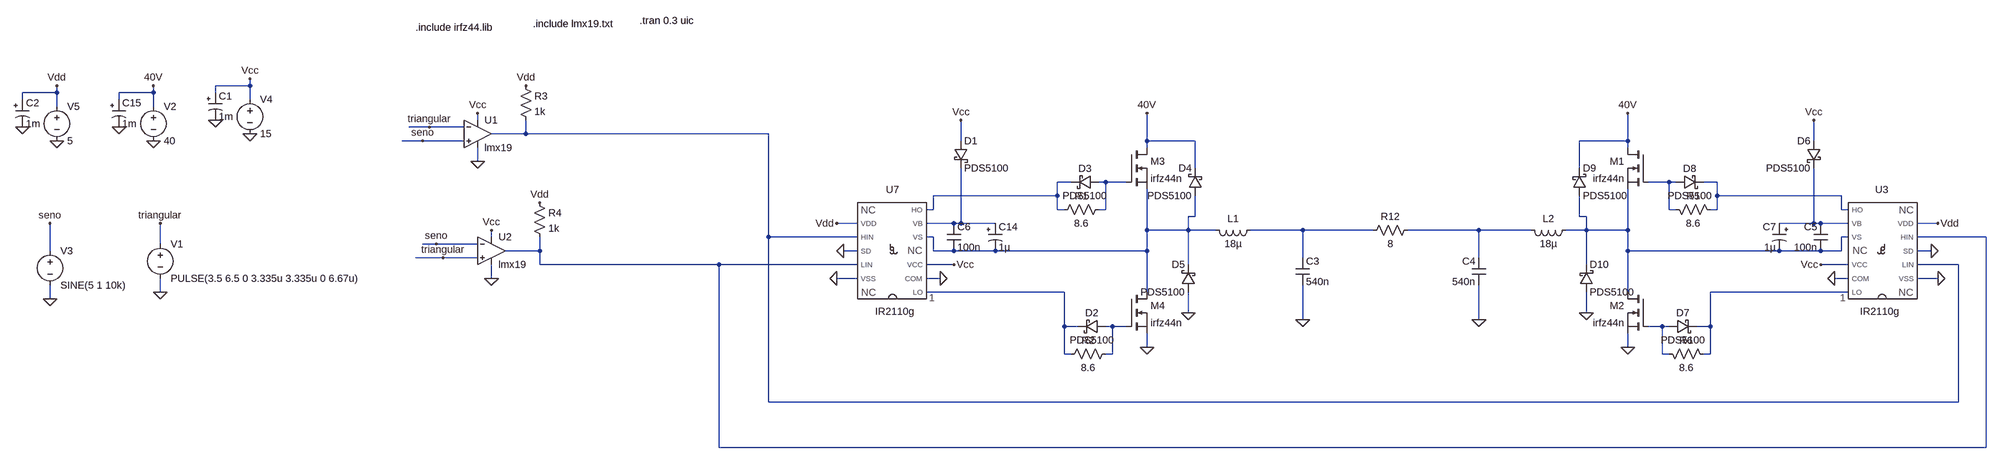
[diagram p0: schematic circuito_completo.asc]
circuito_completo.asc, the LTspice schematic file:
Version 4
SHEET 1 3828 1224
WIRE -704 48 -704 32
WIRE -704 48 -784 48
WIRE -1152 64 -1152 48
WIRE -1152 64 -1232 64
WIRE -928 64 -928 48
WIRE -928 64 -1008 64
WIRE -784 64 -784 48
WIRE -1232 80 -1232 64
WIRE -1008 80 -1008 64
WIRE -704 80 -704 48
WIRE -1152 96 -1152 64
WIRE -928 96 -928 64
WIRE -112 128 -112 112
WIRE -224 144 -272 144
WIRE -144 144 -224 144
WIRE 0 160 0 128
WIRE 0 160 -80 160
WIRE 656 160 0 160
WIRE -240 176 -288 176
WIRE -144 176 -240 176
WIRE 1216 176 1216 128
WIRE 1648 176 1648 112
WIRE 1760 176 1648 176
WIRE 2992 176 2992 112
WIRE 2992 176 2880 176
WIRE 3424 176 3424 128
WIRE 1648 192 1648 176
WIRE 2992 192 2992 176
WIRE -112 224 -112 192
WIRE 1760 240 1760 176
WIRE 2880 240 2880 176
WIRE 1472 272 1440 272
WIRE 1552 272 1536 272
WIRE 1600 272 1552 272
WIRE 3088 272 3040 272
WIRE 3104 272 3088 272
WIRE 3200 272 3168 272
WIRE 1440 304 1440 272
WIRE 1440 304 1152 304
WIRE 3200 304 3200 272
WIRE 3488 304 3200 304
WIRE 1152 336 1152 304
WIRE 1152 336 1136 336
WIRE 1440 336 1440 304
WIRE 1456 336 1440 336
WIRE 1552 336 1552 272
WIRE 1552 336 1536 336
WIRE 3088 336 3088 272
WIRE 3104 336 3088 336
WIRE 3200 336 3200 304
WIRE 3200 336 3184 336
WIRE 3488 336 3488 304
WIRE 3504 336 3488 336
WIRE 1760 352 1760 304
WIRE 1760 352 1744 352
WIRE 2880 352 2880 304
WIRE 2896 352 2880 352
WIRE 976 368 928 368
WIRE 1200 368 1136 368
WIRE 1216 368 1216 240
WIRE 1216 368 1200 368
WIRE 1296 368 1216 368
WIRE 3424 368 3424 240
WIRE 3424 368 3344 368
WIRE 3440 368 3424 368
WIRE 3504 368 3440 368
WIRE 3712 368 3664 368
WIRE 1648 384 1648 288
WIRE 1744 384 1744 352
WIRE 1744 384 1648 384
WIRE 1808 384 1744 384
WIRE 2096 384 1888 384
WIRE 2288 384 2096 384
WIRE 2560 384 2368 384
WIRE 2768 384 2560 384
WIRE 2896 384 2896 352
WIRE 2896 384 2848 384
WIRE 2992 384 2992 288
WIRE 2992 384 2896 384
WIRE -80 400 -80 384
WIRE 656 400 656 160
WIRE 976 400 656 400
WIRE 1152 400 1136 400
WIRE 3504 400 3488 400
WIRE 3824 400 3664 400
WIRE -912 416 -912 368
WIRE -208 416 -240 416
WIRE -112 416 -208 416
WIRE -1168 432 -1168 368
WIRE 32 432 32 400
WIRE 32 432 -48 432
WIRE 976 432 944 432
WIRE 1152 432 1152 400
WIRE 1200 432 1152 432
WIRE 1296 432 1200 432
WIRE 1648 432 1648 384
WIRE 1648 432 1296 432
WIRE 2992 432 2992 384
WIRE 3344 432 2992 432
WIRE 3440 432 3344 432
WIRE 3488 432 3488 400
WIRE 3488 432 3440 432
WIRE 3696 432 3664 432
WIRE -192 448 -256 448
WIRE -112 448 -192 448
WIRE 2096 448 2096 384
WIRE 2560 448 2560 384
WIRE 32 464 32 432
WIRE 448 464 32 464
WIRE 976 464 448 464
WIRE 1200 464 1136 464
WIRE 1744 464 1744 384
WIRE 2896 464 2896 384
WIRE 3504 464 3440 464
WIRE 3760 464 3664 464
WIRE -80 496 -80 464
WIRE 976 496 928 496
WIRE 1168 496 1136 496
WIRE 3504 496 3472 496
WIRE 3712 496 3664 496
WIRE -912 528 -912 496
WIRE 1456 528 1136 528
WIRE 1648 528 1648 432
WIRE 2992 528 2992 432
WIRE 3504 528 3184 528
WIRE -1168 544 -1168 512
WIRE 1744 576 1744 528
WIRE 2896 576 2896 528
WIRE 2096 592 2096 512
WIRE 2560 592 2560 512
WIRE 1456 608 1456 528
WIRE 1488 608 1456 608
WIRE 1568 608 1552 608
WIRE 1600 608 1568 608
WIRE 3072 608 3040 608
WIRE 3088 608 3072 608
WIRE 3184 608 3184 528
WIRE 3184 608 3152 608
WIRE 1648 656 1648 624
WIRE 2992 656 2992 624
WIRE 1456 672 1456 608
WIRE 1472 672 1456 672
WIRE 1568 672 1568 608
WIRE 1568 672 1552 672
WIRE 3072 672 3072 608
WIRE 3088 672 3072 672
WIRE 3184 672 3184 608
WIRE 3184 672 3168 672
WIRE 656 784 656 400
WIRE 3760 784 3760 464
WIRE 3760 784 656 784
WIRE 448 896 448 464
WIRE 3824 896 3824 400
WIRE 3824 896 448 896
FLAG -928 176 0
FLAG -928 48 40V
FLAG 928 368 Vdd
FLAG 1200 464 Vcc
FLAG 928 496 0
FLAG 1168 496 0
FLAG 1216 128 Vcc
FLAG -912 528 0
FLAG -912 368 triangular
FLAG -1008 144 0
FLAG 944 432 0
FLAG -704 160 0
FLAG -704 32 Vcc
FLAG -784 128 0
FLAG -1152 176 0
FLAG -1152 48 Vdd
FLAG -1232 144 0
FLAG 1648 112 40V
FLAG 1648 656 0
FLAG 1744 576 0
FLAG -112 112 Vcc
FLAG 0 48 Vdd
FLAG -112 224 0
FLAG -224 144 triangular
FLAG -240 176 seno
FLAG -80 384 Vcc
FLAG 32 320 Vdd
FLAG -80 496 0
FLAG -208 416 seno
FLAG -192 448 triangular
FLAG -1168 544 0
FLAG -1168 368 seno
FLAG 2096 592 0
FLAG 2560 592 0
FLAG 3712 368 Vdd
FLAG 3440 464 Vcc
FLAG 3712 496 0
FLAG 3472 496 0
FLAG 3424 128 Vcc
FLAG 3696 432 0
FLAG 2992 112 40V
FLAG 2992 656 0
FLAG 2896 576 0
SYMBOL voltage -928 80 R0
SYMATTR InstName V2
SYMATTR Value 40
SYMBOL ind 1904 368 R90
WINDOW 0 5 56 VBottom 2
WINDOW 3 32 56 VTop 2
SYMATTR InstName L1
SYMATTR Value 18µ
SYMBOL res 2384 368 R90
WINDOW 0 0 56 VBottom 2
WINDOW 3 32 56 VTop 2
SYMATTR InstName R12
SYMATTR Value 8
SYMBOL cap 2080 448 R0
SYMATTR InstName C3
SYMATTR Value 540n
SYMBOL IR2110g 1056 432 R0
SYMATTR InstName U7
SYMBOL cap 1184 368 R0
SYMATTR InstName C6
SYMATTR Value 100n
SYMBOL voltage -912 400 R0
WINDOW 123 0 0 Left 2
WINDOW 39 0 0 Left 2
SYMATTR InstName V1
SYMATTR Value PULSE(3.5 6.5 0 3.335u 3.335u 0 6.67u)
SYMBOL polcap -1024 80 R0
SYMATTR InstName C15
SYMATTR Value 1m
SYMBOL polcap 1280 368 R0
SYMATTR InstName C14
SYMATTR Value 1µ
SYMBOL voltage -704 64 R0
SYMATTR InstName V4
SYMATTR Value 15
SYMBOL polcap -800 64 R0
SYMATTR InstName C1
SYMATTR Value 1m
SYMBOL voltage -1152 80 R0
SYMATTR InstName V5
SYMATTR Value 5
SYMBOL polcap -1248 80 R0
SYMATTR InstName C2
SYMATTR Value 1m
SYMBOL nmos 1600 192 R0
SYMATTR InstName M3
SYMATTR Value irfz44n
SYMBOL nmos 1600 528 R0
SYMATTR InstName M4
SYMATTR Value irfz44n
SYMBOL res 1552 320 R90
WINDOW 0 0 56 VBottom 2
WINDOW 3 32 56 VTop 2
SYMATTR InstName R1
SYMATTR Value 8.6
SYMBOL res 1568 656 R90
WINDOW 0 0 56 VBottom 2
WINDOW 3 32 56 VTop 2
SYMATTR InstName R2
SYMATTR Value 8.6
SYMBOL Opamps\\opamp2 -112 96 R0
SYMATTR InstName U1
SYMATTR Value lmx19
SYMBOL res -16 32 R0
SYMATTR InstName R3
SYMATTR Value 1k
SYMBOL Opamps\\opamp2 -80 368 R0
SYMATTR InstName U2
SYMATTR Value lmx19
SYMBOL res 16 304 R0
SYMATTR InstName R4
SYMATTR Value 1k
SYMBOL schottky 1200 176 R0
SYMATTR InstName D1
SYMATTR Value PDS5100
SYMATTR Description Diode
SYMATTR Type diode
SYMBOL schottky 1552 592 R90
WINDOW 0 0 32 VBottom 2
WINDOW 3 32 32 VTop 2
SYMATTR InstName D2
SYMATTR Value PDS5100
SYMATTR Description Diode
SYMATTR Type diode
SYMBOL schottky 1536 256 R90
WINDOW 0 0 32 VBottom 2
WINDOW 3 32 32 VTop 2
SYMATTR InstName D3
SYMATTR Value PDS5100
SYMATTR Description Diode
SYMATTR Type diode
SYMBOL schottky 1776 304 R180
WINDOW 0 24 64 Left 2
WINDOW 3 24 0 Left 2
SYMATTR InstName D4
SYMATTR Value PDS5100
SYMATTR Description Diode
SYMATTR Type diode
SYMBOL schottky 1760 528 R180
WINDOW 0 24 64 Left 2
WINDOW 3 24 0 Left 2
SYMATTR InstName D5
SYMATTR Value PDS5100
SYMATTR Description Diode
SYMATTR Type diode
SYMBOL voltage -1168 416 R0
WINDOW 123 0 0 Left 2
WINDOW 39 0 0 Left 2
SYMATTR InstName V3
SYMATTR Value SINE(5 1 10k)
SYMBOL ind 2752 368 M90
WINDOW 0 5 56 VBottom 2
WINDOW 3 32 56 VTop 2
SYMATTR InstName L2
SYMATTR Value 18µ
SYMBOL cap 2576 448 M0
SYMATTR InstName C4
SYMATTR Value 540n
SYMBOL IR2110g 3584 432 M0
SYMATTR InstName U3
SYMBOL cap 3456 368 M0
SYMATTR InstName C5
SYMATTR Value 100n
SYMBOL polcap 3360 368 M0
SYMATTR InstName C7
SYMATTR Value 1µ
SYMBOL nmos 3040 192 M0
SYMATTR InstName M1
SYMATTR Value irfz44n
SYMBOL nmos 3040 528 M0
SYMATTR InstName M2
SYMATTR Value irfz44n
SYMBOL res 3088 320 M90
WINDOW 0 0 56 VBottom 2
WINDOW 3 32 56 VTop 2
SYMATTR InstName R5
SYMATTR Value 8.6
SYMBOL res 3072 656 M90
WINDOW 0 0 56 VBottom 2
WINDOW 3 32 56 VTop 2
SYMATTR InstName R6
SYMATTR Value 8.6
SYMBOL schottky 3440 176 M0
SYMATTR InstName D6
SYMATTR Value PDS5100
SYMATTR Description Diode
SYMATTR Type diode
SYMBOL schottky 3088 592 M90
WINDOW 0 0 32 VBottom 2
WINDOW 3 32 32 VTop 2
SYMATTR InstName D7
SYMATTR Value PDS5100
SYMATTR Description Diode
SYMATTR Type diode
SYMBOL schottky 3104 256 M90
WINDOW 0 0 32 VBottom 2
WINDOW 3 32 32 VTop 2
SYMATTR InstName D8
SYMATTR Value PDS5100
SYMATTR Description Diode
SYMATTR Type diode
SYMBOL schottky 2864 304 M180
WINDOW 0 24 64 Left 2
WINDOW 3 24 0 Left 2
SYMATTR InstName D9
SYMATTR Value PDS5100
SYMATTR Description Diode
SYMATTR Type diode
SYMBOL schottky 2880 528 M180
WINDOW 0 24 64 Left 2
WINDOW 3 24 0 Left 2
SYMATTR InstName D10
SYMATTR Value PDS5100
SYMATTR Description Diode
SYMATTR Type diode
TEXT 264 -104 Left 2 !.tran 0.3 uic
TEXT 16 -96 Left 2 !.include lmx19.txt
TEXT -256 -88 Left 2 !.include irfz44.lib

The netlist it stands for:
* circuito_completo.asc
V2 40V 0 40
L1 N010 N006 18µ
R12 N011 N010 8
C3 N010 0 540n
XU7 0 N001 N012 0 N008 Vcc Vdd N006 0 N002 N013 IR2110g IR2110g  ; pins COM HIN LIN SD VB VCC VDD VS VSS HO LO
C6 N008 N006 100n
V1 triangular 0 PULSE(3.5 6.5 0 3.335u 3.335u 0 6.67u)
C15 40V 0 1m
C14 N008 N006 1µ
V4 Vcc 0 15
C1 Vcc 0 1m
V5 Vdd 0 5
C2 Vdd 0 1m
M3 40V N003 N006 N006 irfz44n
M4 N006 N015 0 0 irfz44n
R1 N003 N002 8.6
R2 N015 N013 8.6
XU1 seno triangular Vcc 0 N001 lmx19  ; pins In+ In- V+ V- OUT
R3 Vdd N001 1k
XU2 triangular seno Vcc 0 N012 lmx19  ; pins In+ In- V+ V- OUT
R4 Vdd N012 1k
D1 Vcc N008 PDS5100
D2 N015 N013 PDS5100
D3 N003 N002 PDS5100
D4 N006 40V PDS5100
D5 0 N006 PDS5100
V3 seno 0 SINE(5 1 10k)
L2 N011 N007 18µ
C4 N011 0 540n
XU3 0 N012 N001 0 N009 Vcc Vdd N007 0 N005 N014 IR2110g IR2110g  ; pins COM HIN LIN SD VB VCC VDD VS VSS HO LO
C5 N009 N007 100n
C7 N009 N007 1µ
M1 40V N004 N007 N007 irfz44n
M2 N007 N016 0 0 irfz44n
R5 N004 N005 8.6
R6 N016 N014 8.6
D6 Vcc N009 PDS5100
D7 N016 N014 PDS5100
D8 N004 N005 PDS5100
D9 N007 40V PDS5100
D10 0 N007 PDS5100
.model D D
.lib standard.dio
.model NMOS NMOS
.model PMOS PMOS
.lib standard.mos
.tran 0.3 uic
.include lmx19.txt
.include irfz44.lib
.lib IR2110g.sub
.backanno
.end